# EAGLE design Draft1 (EAGLE 9.6.2)

## Sheet 1 of 7: Power
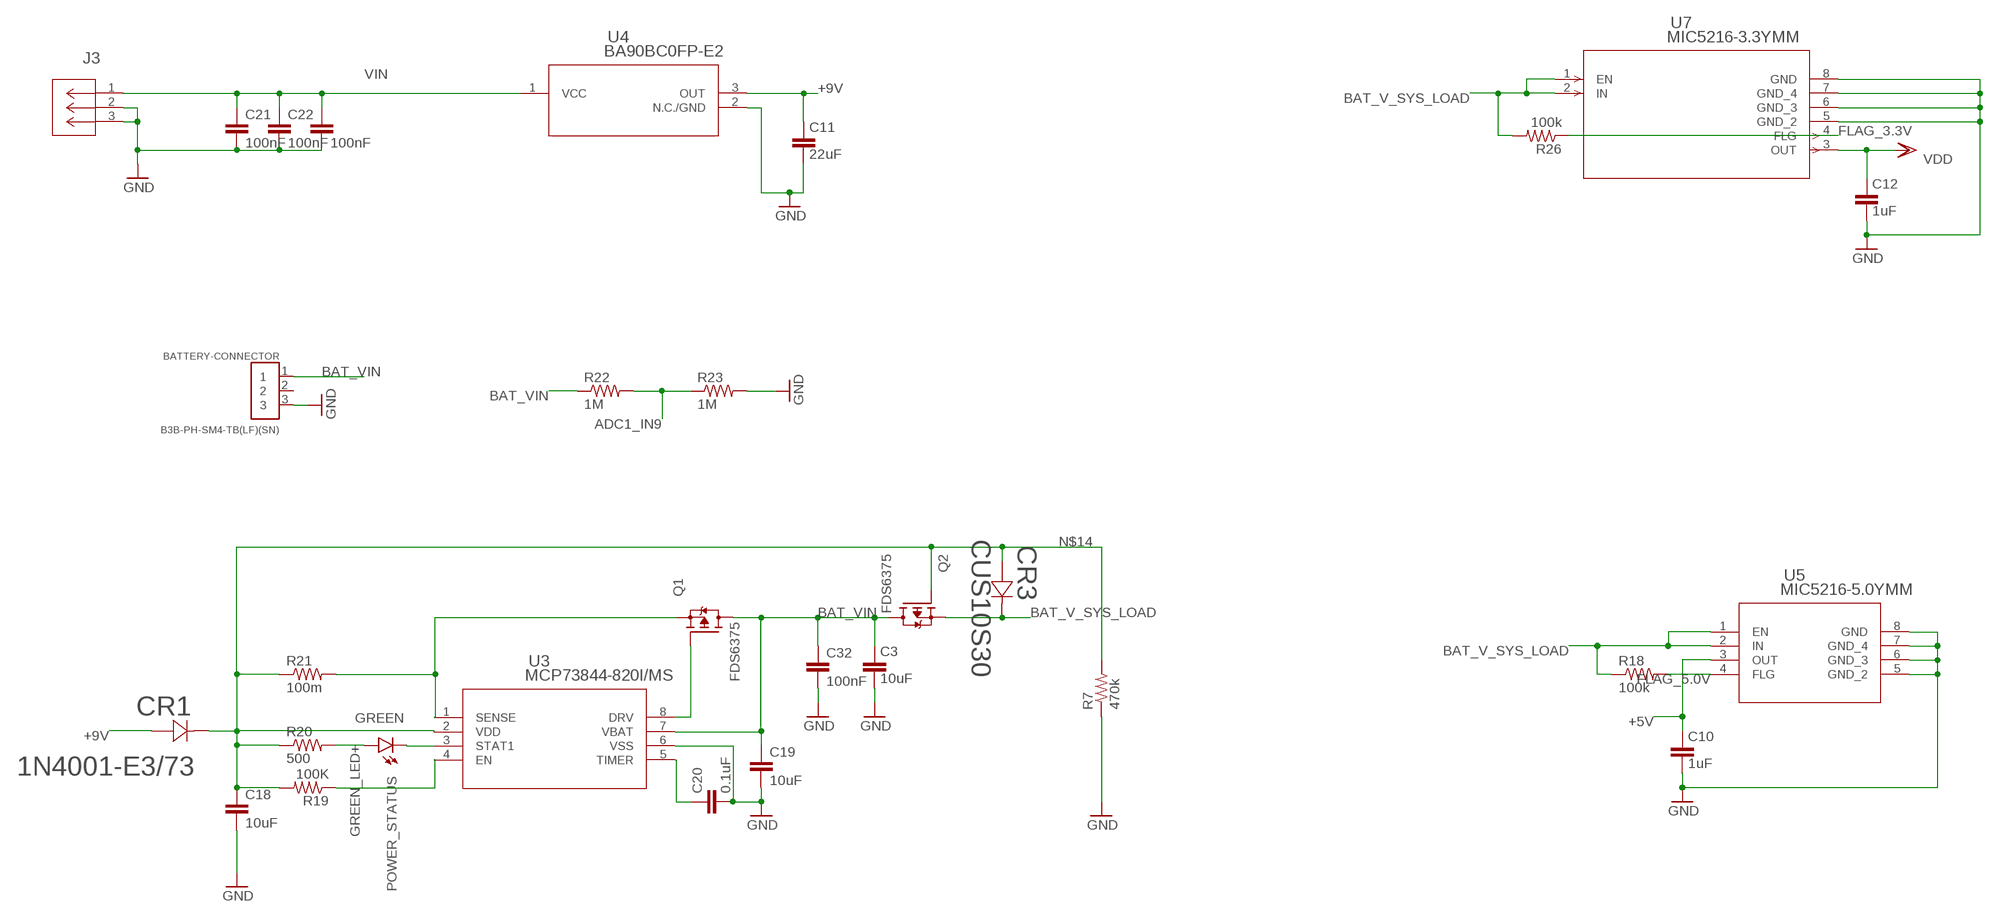
[diagram p0: schematic, sheet 1]

### Parts
BATTERY-CONNECTOR  B3B-PH-SM4-TB(LF)(SN)  [JST_B3B-PH-SM4-TB(LF)(SN)]
C3  10uF  C-EUC0603  [C0603]
C10  1uF  C-EUC0603  [C0603]
C11  22uF  C-EUC0603  [C0603]
C12  1uF  C-EUC0603  [C0603]
C18  10uF  C-EUC0603  [C0603]
C19  10uF  C-EUC0603  [C0603]
C20  0.1uF  C-EUC0603  [C0603]
C21  100nF  C-EUC0603  [C0603]
C22  100nF  C-EUC0603  [C0603]
C23  100nF  C-EUC0603  [C0603]
C32  100nF  C-EUC0603  [C0603]
CR1  1N4001-E3/73  [DO-204AL_VIS]
CR3  CUS10S30  [USC_TOS]
J3  EJ503B  [CONN_EJ503B_MPD]
POWER_STATUS  GREEN  LEDSMT1206  [1206]
Q1  FDS6375  [SOIC127P600X175-8N]
Q2  FDS6375  [SOIC127P600X175-8N]
R7  470k  R-US_R0603  [R0603]
R18  100k  R-US_R0603  [R0603]
R19  100K  R-US_R0603  [R0603]
R20  500  R-US_R0603  [R0603]
R21  100m  R-US_R0603  [R0603]
R22  1M  R-US_R0603  [R0603]
R23  1M  R-US_R0603  [R0603]
R26  100k  R-US_R0603  [R0603]
U3  MCP73844-820I/MS  [MSOP8_MC_MCH]
U4  BA90BC0FP-E2  [TO252-3_ROM]
U5  MIC5216-5.0YMM  [MSOP8_MM_MCH]
U7  MIC5216-3.3YMM  [MSOP-8_MM_MCL]

### Nets
+5V: C10.1 U5.3(OUT) ; also sheet 5,6
+9V: C11.1 CR1.2 U4.3(OUT)
ADC1_IN9: R22.2 R23.1 ; also sheet 2
BAT_V_SYS_LOAD: CR3.1(CATHODE) Q2.1(S) Q2.2(S) Q2.3(S) R18.1 R26.2 U5.1(EN) U5.2(IN) U7.1(EN) U7.2(IN)
BAT_VIN: BATTERY-CONNECTOR.1 C3.1 C19.1 C32.1 Q1.5(D) Q1.6(D) Q1.7(D) Q1.8(D) Q2.5(D) Q2.6(D) Q2.7(D) Q2.8(D) R22.1 U3.7(VBAT)
FLAG_3.3V: R26.1 U7.4(FLG)
FLAG_5.0V: R18.2 U5.4(FLG)
GND: BATTERY-CONNECTOR.3 C3.2 C10.2 C11.2 C12.2 C18.2 C19.2 C20.2 C21.2 C22.2 C23.2 C32.2 J3.2 J3.3 R7.1 R23.2 U3.6(VSS) U4.2(N.C./GND) U5.5(GND_2) U5.6(GND_3) U5.7(GND_4) U5.8(GND) U7.5(GND_2) U7.6(GND_3) U7.7(GND_4) U7.8(GND) ; also sheet 2,3,4,5,6,7
GREEN_LED+: POWER_STATUS.A R20.2
N$14: C18.1 CR1.1 CR3.2(ANODE) Q2.4(G) R7.2 R19.2 R20.1 R21.1 U3.2(VDD)
N$15: R19.1 U3.4(EN)
N$16: POWER_STATUS.C U3.3(STAT1)
N$18: Q1.4(G) U3.8(DRV)
N$19: Q1.1(S) Q1.2(S) Q1.3(S) R21.2 U3.1(SENSE)
N$20: C20.1 U3.5(TIMER)
VDD: C12.1 U7.3(OUT) ; also sheet 2,3,4,6,7
VIN: C21.1 C22.1 C23.1 J3.1 U4.1(VCC)
Unconnected: BATTERY-CONNECTOR.2

## Sheet 2 of 7: MCU
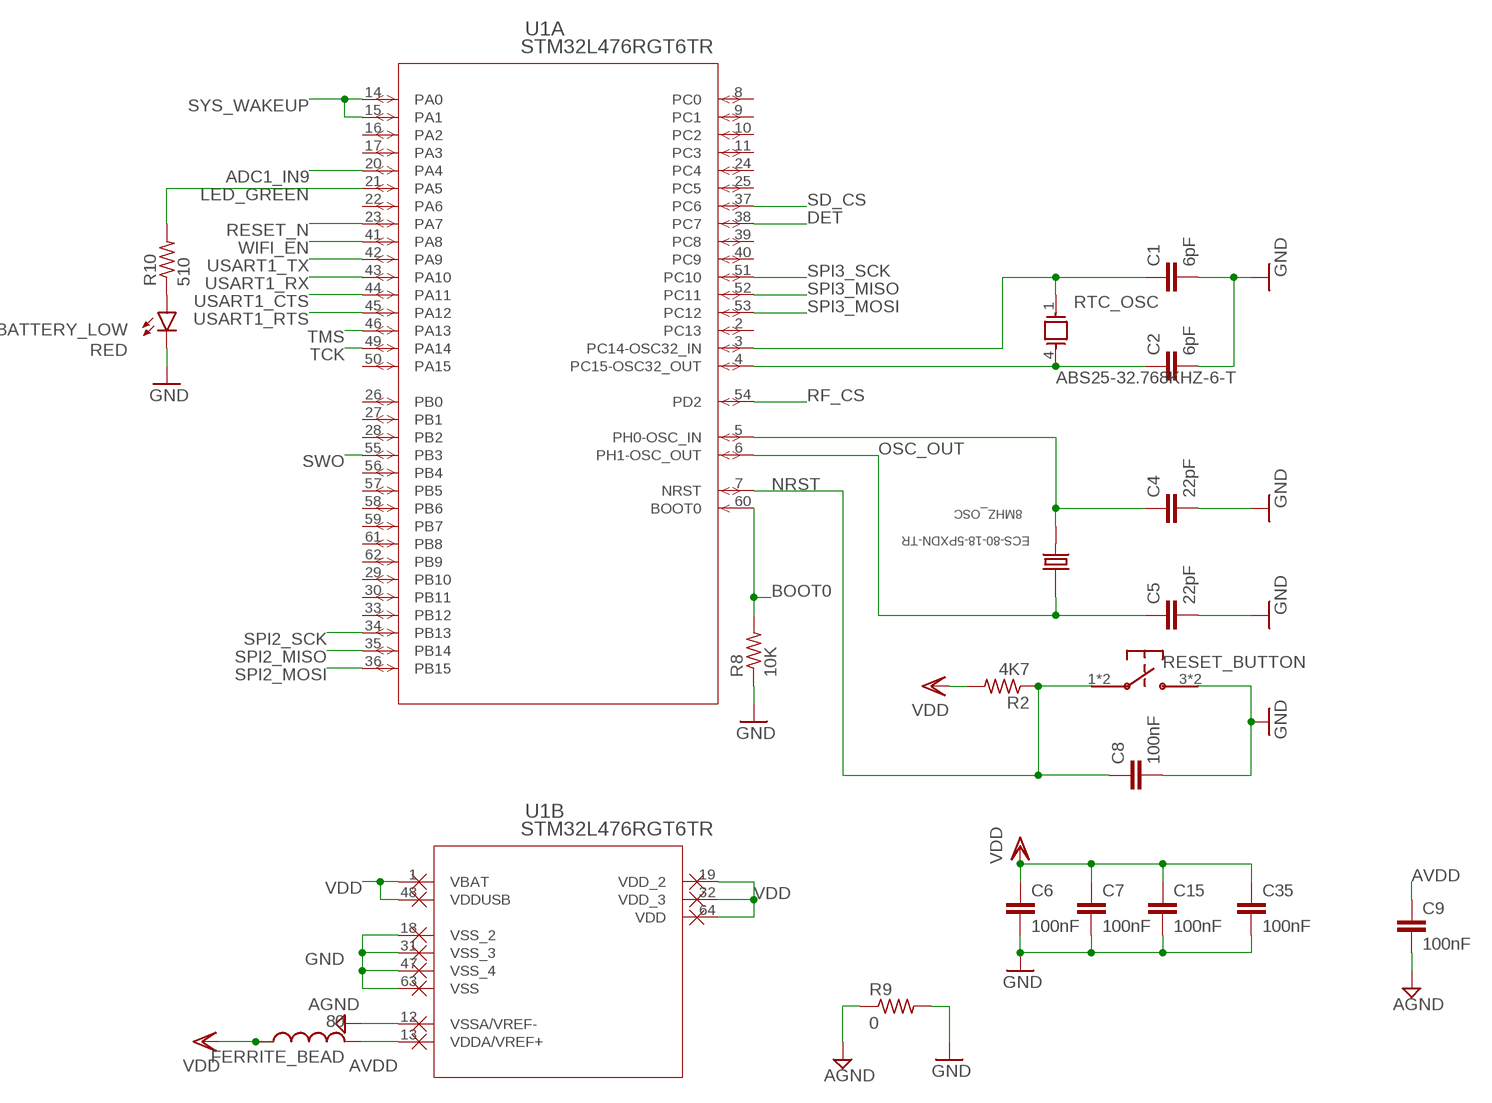
[diagram p1: schematic, sheet 2]

### Parts
8MHZ_OSC  ECS-80-18-5PXDN-TR  [XTAL_ECS-80-18-5PXDN-TR]
BATTERY_LOW  RED  LEDSMT1206  [1206]
C1  6pF  C-EUC0603  [C0603]
C2  6pF  C-EUC0603  [C0603]
C4  22pF  C-EUC0603  [C0603]
C5  22pF  C-EUC0603  [C0603]
C6  100nF  C-EUC0603  [C0603]
C7  100nF  C-EUC0603  [C0603]
C8  100nF  C-EUC0603  [C0603]
C9  100nF  C-EUC0603  [C0603]
C15  100nF  C-EUC0603  [C0603]
C35  100nF  C-EUC0603  [C0603]
FERRITE_BEAD  80  L-USL3216C  [L3216C]
R2  4K7  R-US_R0603  [R0603]
R8  10K  R-US_R0603  [R0603]
R9  0  R-US_R0603  [R0603]
R10  510  R-US_R0603  [R0603]
RESET_BUTTON  PTS645SM43SMTR  [PTS645SM43SMTR]
RTC_OSC  ABS25-32.768KHZ-6-T  [XTAL_ABS25-32.768KHZ-6-T]
U1  STM32L476RGT6TR  [LQFP64-10X10MM]

### Nets
ADC1_IN9: U1.20(A:PA4) ; also sheet 1
AGND: C9.2 R9.1 U1.12(B:VSSA/VREF-)
AVDD: C9.1 FERRITE_BEAD.2 U1.13(B:VDDA/VREF+)
BOOT0: R8.2 U1.60(A:BOOT0)
DET: U1.38(A:PC7) ; also sheet 4
GND: BATTERY_LOW.C C1.2 C2.2 C4.2 C5.2 C6.2 C7.2 C8.2 C15.2 C35.2 R8.1 R9.2 RESET_BUTTON.3 RESET_BUTTON.4 U1.18(B:VSS_2) U1.31(B:VSS_3) U1.47(B:VSS_4) U1.63(B:VSS) ; also sheet 1,3,4,5,6,7
LED_GREEN: R10.2 U1.21(A:PA5)
N$2: BATTERY_LOW.A R10.1
N$6: C1.1 RTC_OSC.1 U1.3(A:PC14-OSC32_IN)
N$8: C2.1 RTC_OSC.4 U1.4(A:PC15-OSC32_OUT)
NRST: C8.1 R2.1 RESET_BUTTON.1 RESET_BUTTON.2 U1.7(A:NRST) ; also sheet 3
OSC_IN: 8MHZ_OSC.2 C4.1 U1.5(A:PH0-OSC_IN)
OSC_OUT: 8MHZ_OSC.1 C5.1 U1.6(A:PH1-OSC_OUT) ; also sheet 6
RESET_N: U1.23(A:PA7) ; also sheet 7
RF_CS: U1.54(A:PD2) ; also sheet 6
SD_CS: U1.37(A:PC6) ; also sheet 4
SPI2_MISO: U1.35(A:PB14) ; also sheet 4
SPI2_MOSI: U1.36(A:PB15) ; also sheet 4
SPI2_SCK: U1.34(A:PB13) ; also sheet 4
SPI3_MISO: U1.52(A:PC11) ; also sheet 6
SPI3_MOSI: U1.53(A:PC12) ; also sheet 6
SPI3_SCK: U1.51(A:PC10) ; also sheet 6
SWO: U1.55(A:PB3) ; also sheet 3
SYS_WAKEUP: U1.14(A:PA0) U1.15(A:PA1) ; also sheet 5
TCK: U1.49(A:PA14) ; also sheet 3
TMS: U1.46(A:PA13) ; also sheet 3
USART1_CTS: U1.44(A:PA11) ; also sheet 7
USART1_RTS: U1.45(A:PA12) ; also sheet 7
USART1_RX: U1.43(A:PA10) ; also sheet 7
USART1_TX: U1.42(A:PA9) ; also sheet 7
VDD: C6.1 C7.1 C15.1 C35.1 FERRITE_BEAD.1 R2.2 U1.1(B:VBAT) U1.19(B:VDD_2) U1.32(B:VDD_3) U1.48(B:VDDUSB) U1.64(B:VDD) ; also sheet 1,3,4,6,7
WIFI_EN: U1.41(A:PA8) ; also sheet 7
Unconnected: U1.2(A:PC13) U1.8(A:PC0) U1.9(A:PC1) U1.10(A:PC2) U1.11(A:PC3) U1.16(A:PA2) U1.17(A:PA3) U1.22(A:PA6) U1.24(A:PC4) U1.25(A:PC5) U1.26(A:PB0) U1.27(A:PB1) U1.28(A:PB2) U1.29(A:PB10) U1.30(A:PB11) U1.33(A:PB12) U1.39(A:PC8) U1.40(A:PC9) U1.50(A:PA15) U1.56(A:PB4) U1.57(A:PB5) U1.58(A:PB6) U1.59(A:PB7) U1.61(A:PB8) U1.62(A:PB9)

## Sheet 3 of 7: STLINK
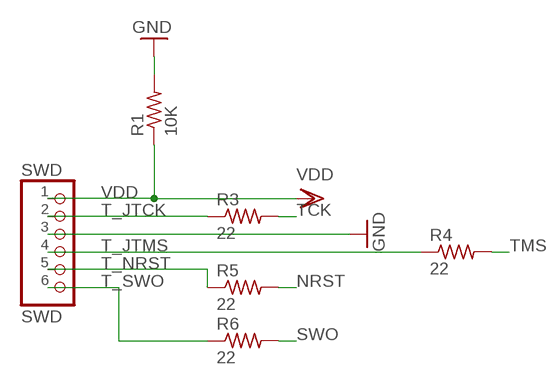
[diagram p2: schematic, sheet 3]

### Parts
R1  10K  R-US_R0603  [R0603]
R3  22  R-US_R0603  [R0603]
R4  22  R-US_R0603  [R0603]
R5  22  R-US_R0603  [R0603]
R6  22  R-US_R0603  [R0603]
SWD  SWD  PINHD-1X6  [1X06]

### Nets
GND: R1.2 SWD.3 ; also sheet 1,2,4,5,6,7
NRST: R5.2 ; also sheet 2
SWO: R6.2 ; also sheet 2
T_JTCK: R3.1 SWD.2
T_JTMS: R4.1 SWD.4
T_NRST: R5.1 SWD.5
T_SWO: R6.1 SWD.6
TCK: R3.2 ; also sheet 2
TMS: R4.2 ; also sheet 2
VDD: R1.1 SWD.1 ; also sheet 1,2,4,6,7

## Sheet 4 of 7: microSD
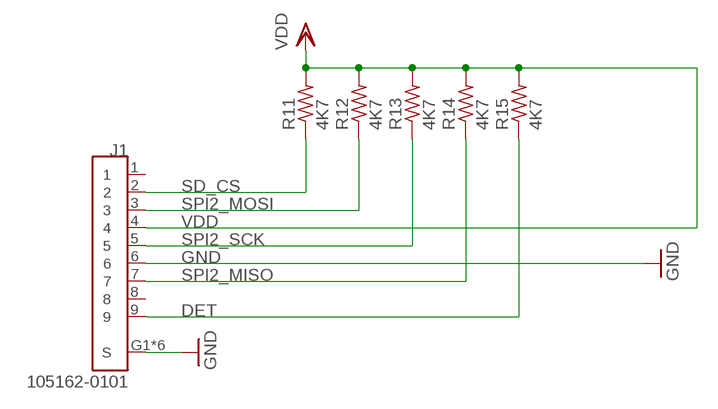
[diagram p3: schematic, sheet 4]

### Parts
J1  105162-0101  [MOLEX_105162-0101]
R11  4K7  R-US_R0603  [R0603]
R12  4K7  R-US_R0603  [R0603]
R13  4K7  R-US_R0603  [R0603]
R14  4K7  R-US_R0603  [R0603]
R15  4K7  R-US_R0603  [R0603]

### Nets
DET: J1.9 R15.1 ; also sheet 2
GND: J1.6 J1.G1(S) J1.G2(S) J1.G3(S) J1.G4(S) J1.SH1(S) J1.SH2(S) ; also sheet 1,2,3,5,6,7
SD_CS: J1.2 R11.1 ; also sheet 2
SPI2_MISO: J1.7 R14.1 ; also sheet 2
SPI2_MOSI: J1.3 R12.1 ; also sheet 2
SPI2_SCK: J1.5 R13.1 ; also sheet 2
VDD: J1.4 R11.2 R12.2 R13.2 R14.2 R15.2 ; also sheet 1,2,3,6,7
Unconnected: J1.1 J1.8

## Sheet 5 of 7: Infrared Motion Sensor Connectors
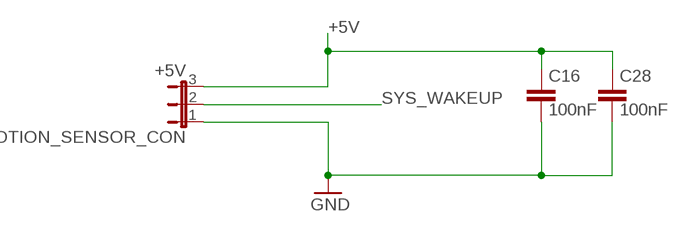
[diagram p4: schematic, sheet 5]

### Parts
C16  100nF  C-EUC0603  [C0603]
C28  100nF  C-EUC0603  [C0603]
MOTION_SENSOR_CON  +5V  JP2E  [JP2]

### Nets
+5V: C16.1 C28.1 MOTION_SENSOR_CON.3 ; also sheet 1,6
GND: C16.2 C28.2 MOTION_SENSOR_CON.1 ; also sheet 1,2,3,4,6,7
SYS_WAKEUP: MOTION_SENSOR_CON.2 ; also sheet 2

## Sheet 6 of 7: RFID Reader
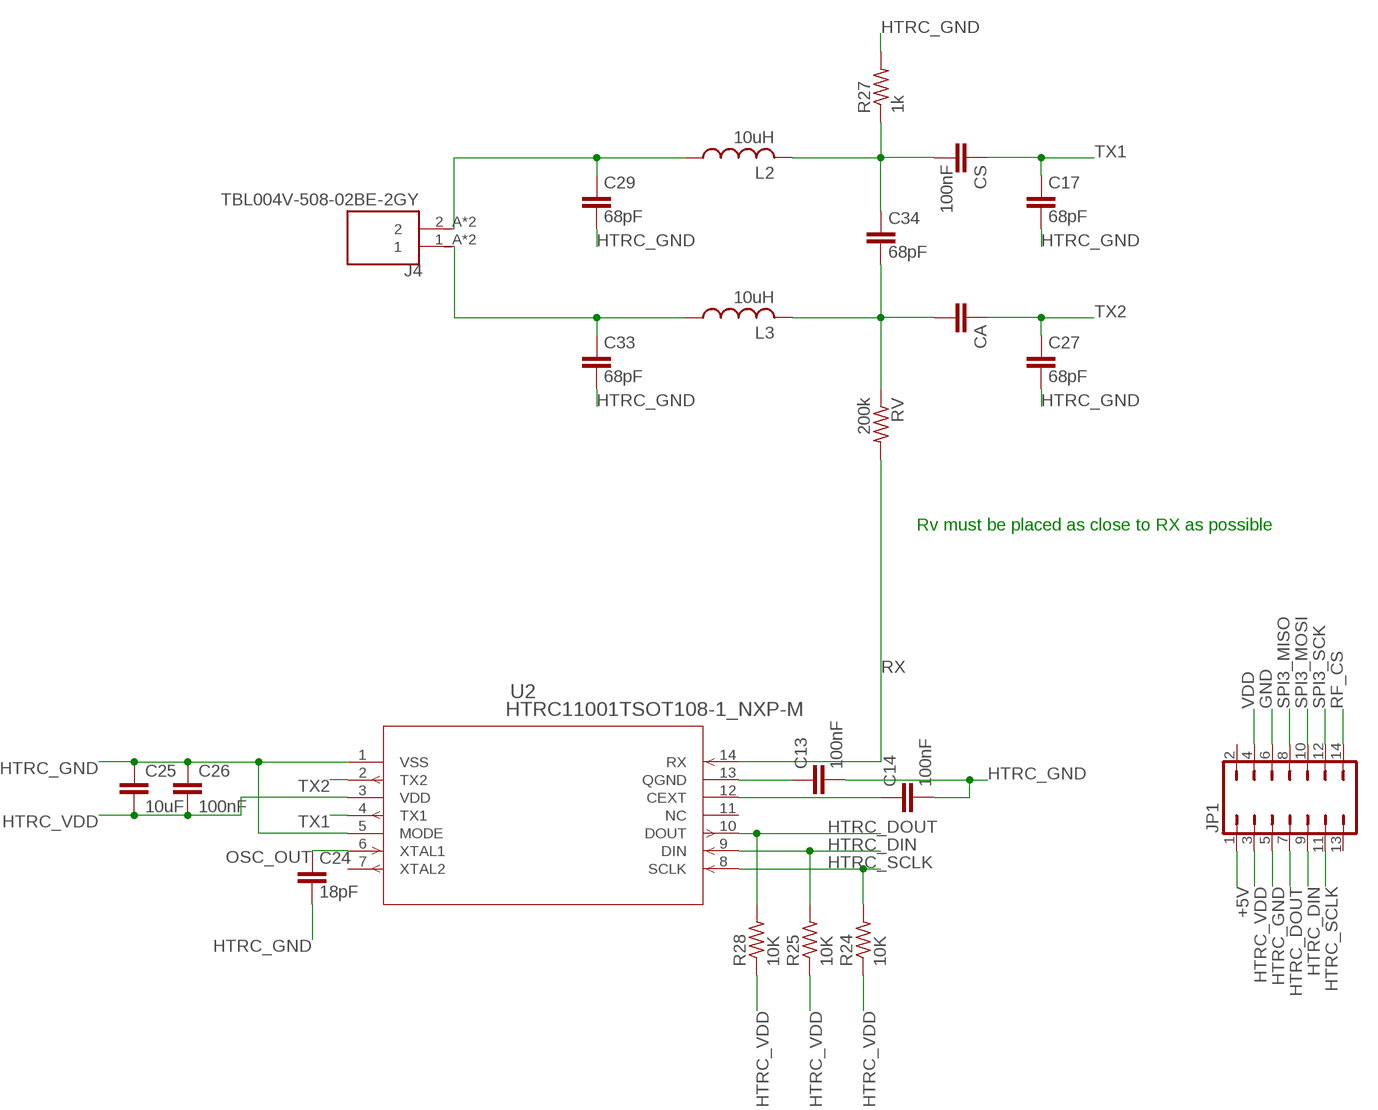
[diagram p5: schematic, sheet 6]

### Parts
C13  100nF  C-EUC0603  [C0603]
C14  100nF  C-EUC0603  [C0603]
C17  68pF  C-EUC0603  [C0603]
C24  18pF  C-EUC0603  [C0603]
C25  10uF  C-EUC0603  [C0603]
C26  100nF  C-EUC0603  [C0603]
C27  68pF  C-EUC0603  [C0603]
C29  68pF  C-EUC0603  [C0603]
C33  68pF  C-EUC0603  [C0603]
C34  68pF  C-EUC0603  [C0603]
CA  C-EUC0603  [C0603]
CS  100nF  C-EUC0603  [C0603]
J4  TBL004V-508-02BE-2GY  [CUI_TBL004V-508-02BE-2GY]
JP1  JP7Q  [JP7Q]
L2  10uH  L-USL3225M  [L3225M]
L3  10uH  L-USL3225M  [L3225M]
R24  10K  R-US_R0603  [R0603]
R25  10K  R-US_R0603  [R0603]
R27  1k  R-US_R0603  [R0603]
R28  10K  R-US_R0603  [R0603]
RV  200k  R-US_R0603  [R0603]
U2  HTRC11001TSOT108-1_NXP-M  [SOT108-1_NXP-M]

### Nets
+5V: JP1.1 ; also sheet 1,5
GND: JP1.6 ; also sheet 1,2,3,4,5,7
HTRC_DIN: JP1.9 R25.2 U2.9(DIN)
HTRC_DOUT: JP1.7 R28.2 U2.10(DOUT)
HTRC_GND: C13.2 C14.2 C17.2 C24.2 C25.1 C26.1 C27.2 C29.2 C33.2 JP1.5 R27.2 U2.1(VSS) U2.5(MODE)
HTRC_SCLK: JP1.11 R24.2 U2.8(SCLK)
HTRC_VDD: C25.2 C26.2 JP1.3 R24.1 R25.1 R28.1 U2.3(VDD)
N$1: C33.1 J4.1_A J4.1_B L3.1
N$7: C29.1 J4.2_A J4.2_B L2.1
N$10: C34.1 CS.2 L2.2 R27.1
N$11: C13.1 U2.13(QGND)
N$12: C34.2 CA.2 L3.2 RV.1
N$21: C14.1 U2.12(CEXT)
OSC_OUT: C24.1 U2.6(XTAL1) ; also sheet 2
RF_CS: JP1.14 ; also sheet 2
RX: RV.2 U2.14(RX)
SPI3_MISO: JP1.8 ; also sheet 2
SPI3_MOSI: JP1.10 ; also sheet 2
SPI3_SCK: JP1.12 ; also sheet 2
TX1: C17.1 CS.1 U2.4(TX1)
TX2: C27.1 CA.1 U2.2(TX2)
VDD: JP1.4 ; also sheet 1,2,3,4,7
Unconnected: JP1.2 JP1.13 U2.7(XTAL2) U2.11(NC)

### Notes on the sheet
- Rv must be placed as close to RX as possible

## Sheet 7 of 7: WIFI Module
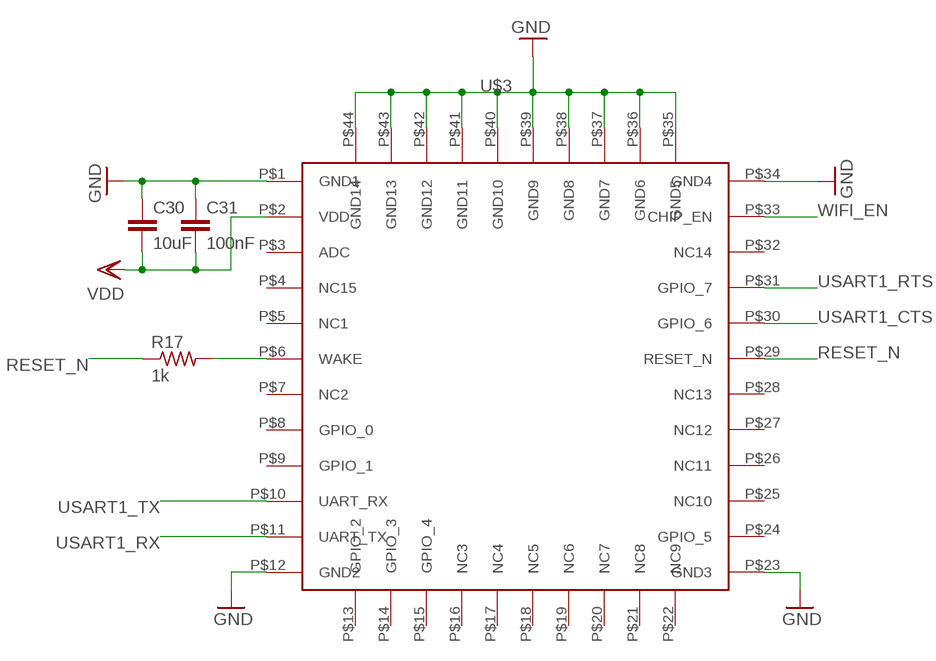
[diagram p6: schematic, sheet 7]

### Parts
C30  10uF  C-EUC0603  [C0603]
C31  100nF  C-EUC0603  [C0603]
R17  1k  R-US_R0603  [R0603]
U$3  AMW037-2.2.14R  [AMW037-2.2.14R]

### Nets
GND: C30.1 C31.1 U$3.P$1(GND1) U$3.P$12(GND2) U$3.P$23(GND3) U$3.P$34(GND4) U$3.P$35(GND5) U$3.P$36(GND6) U$3.P$37(GND7) U$3.P$38(GND8) U$3.P$39(GND9) U$3.P$40(GND10) U$3.P$41(GND11) U$3.P$42(GND12) U$3.P$43(GND13) U$3.P$44(GND14) ; also sheet 1,2,3,4,5,6
N$27: R17.2 U$3.P$6(WAKE)
RESET_N: R17.1 U$3.P$29(RESET_N) ; also sheet 2
USART1_CTS: U$3.P$30(GPIO_6) ; also sheet 2
USART1_RTS: U$3.P$31(GPIO_7) ; also sheet 2
USART1_RX: U$3.P$11(UART_TX) ; also sheet 2
USART1_TX: U$3.P$10(UART_RX) ; also sheet 2
VDD: C30.2 C31.2 U$3.P$2(VDD) ; also sheet 1,2,3,4,6
WIFI_EN: U$3.P$33(CHIP_EN) ; also sheet 2
Unconnected: U$3.P$3(ADC) U$3.P$4(NC15) U$3.P$5(NC1) U$3.P$7(NC2) U$3.P$8(GPIO_0) U$3.P$9(GPIO_1) U$3.P$13(GPIO_2) U$3.P$14(GPIO_3) U$3.P$15(GPIO_4) U$3.P$16(NC3) U$3.P$17(NC4) U$3.P$18(NC5) U$3.P$19(NC6) U$3.P$20(NC7) U$3.P$21(NC8) U$3.P$22(NC9) U$3.P$24(GPIO_5) U$3.P$25(NC10) U$3.P$26(NC11) U$3.P$27(NC12) U$3.P$28(NC13) U$3.P$32(NC14)

## Library data of the parts
8MHZ_OSC = ECS-80-18-5PXDN-TR:ECS-80-18-5PXDN-TR: CRYSTAL SMD; DESCRIPTION: 8 MHz ±30ppm Crystal 18pF 60 Ohms HC-49/US; DIGI-KEY_PART_NUMBER: XC1297CT-ND; MF: ECS Inc.; MP: ECS-80-18-5PXDN-TR; PACKAGE: HC49/US ECS International; PURCHASE-URL: https://pricing.snapeda.com/search/part/ECS-80-18-5PXDN-TR/?ref=eda
BATTERY-CONNECTOR = B3B-PH-SM4-TB_LF__SN_:B3B-PH-SM4-TB(LF)(SN): PH Series 3 Position 2 mm Pitch Crimp Surface Mount Top Entry Shrouded Header; DESCRIPTION: Connector Header Surface Mount 3 position 0.079 (2.00mm); DIGI-KEY_PART_NUMBER: 455-1735-1-ND; MF: JST Sales; MP: B3B-PH-SM4-TB(LF)(SN); PACKAGE: None; PURCHASE-URL: https://pricing.snapeda.com/search/part/B3B-PH-SM4-TB(LF)(SN)/?ref=eda
BATTERY_LOW = led:LED: LED OSRAM: - CHIPLED LG R971, LG N971, LY N971, LG Q971, LY Q971, LO R971, LY R971 LH N974, LH R974 LS Q976, LO Q976, LY Q976 LO Q996 - Hyper CHIPLED LW Q18S LB Q993, LB Q99A, LB R99A - SideLED LS A670, LO A670, LY A670, LG A670, LP A670 LB A673, LV A673, LT A673, LW A673 LH A674 LY A675 LS A676, LA A676, LO A676, LY A676, LW A676 LS A679, LY A679, LG A679 - Hyper Micro SIDELED® LS Y876, LA Y876, LO Y876, LY Y876 LT Y87S - SmartLED LW L88C, LW L88S LB L89C, LB L89S, LG L890 LS L89K, LO L89K, LY L89K LS L896, LA L896, LO L896, LY L896 - TOPLED LS T670, LO T670, LY T670, LG T670, LP T670 LSG T670, LSP T670, LSY T670, LOP T670, LYG T670 LG T671, LOG T671, LSG T671 LB T673, LV T673, LT T673, LW T673 LH T674 LS T676, LA T676, LO T676, LY T676, LB T676, LH T676, LSB T676, LW T676 LB T67C, LV T67C, LT T67C, LS T67K, LO T67K, LY T67K, LW E67C LS E67B, LA E67B, LO E67B, LY E67B, LB E67C, LV E67C, LT E67C LW T67C LS T679, LY T679, LG T679 LS T770, LO T770, LY T770, LG T770, LP T770 LB T773, LV T773, LT T773, LW T773 LH T774 LS E675, LA E675, LY E675, LS T675 LS T776, LA T776, LO T776, LY T776, LB T776 LHGB T686 LT T68C, LB T68C - Hyper Mini TOPLED® LB M676 - Mini TOPLED Santana® LG M470 LS M47K, LO M47K, LY M47K Source: http://www.osram.convergy.de LUXEON: - LUMILED® LXK2-PW12-R00, LXK2-PW12-S00, LXK2-PW14-U00, LXK2-PW14-V00 LXK2-PM12-R00, LXK2-PM12-S00, LXK2-PM14-U00 LXK2-PE12-Q00, LXK2-PE12-R00, LXK2-PE12-S00, LXK2-PE14-T00, LXK2-PE14-U00 LXK2-PB12-K00, LXK2-PB12-L00, LXK2-PB12-M00, LXK2-PB14-N00, LXK2-PB14-P00, LXK2-PB14-Q00 LXK2-PR12-L00, LXK2-PR12-M00, LXK2-PR14-Q00, LXK2-PR14-R00 LXK2-PD12-Q00, LXK2-PD12-R00, LXK2-PD12-S00 LXK2-PH12-R00, LXK2-PH12-S00 LXK2-PL12-P00, LXK2-PL12-Q00, LXK2-PL12-R00 Source: www.luxeon.com KINGBRIGHT: KA-3528ASYC Source: www.kingbright.com
C1-C35 CA CS = rcl:C-EU: CAPACITOR, European symbol; SPICEPREFIX: C
CR1 = 1N4001:1N4001-E3/73; COPYRIGHT: Copyright (C) 2021 Ultra Librarian. All rights reserved.; DIGI-KEY_PART_NUMBER_1: 1N4001-E3/73GICT-ND; DIGI-KEY_PART_NUMBER_2: 1N4001-E3/73GITB-ND; MANUFACTURER_PART_NUMBER: 1N4001-E3/73; MFR_NAME: Vishay; SPICEPREFIX: C
CR3 = CUS10S30:CUS10S30; COPYRIGHT: Copyright (C) 2021 Ultra Librarian. All rights reserved.; DIGI-KEY_PART_NUMBER_1: CUS10S30H3FCT-ND; DIGI-KEY_PART_NUMBER_2: CUS10S30H3FDKR-ND; DIGI-KEY_PART_NUMBER_3: CUS10S30H3FTR-ND; MANUFACTURER_PART_NUMBER: CUS10S30; MFR_NAME: Toshiba Electronic Devices & Storage Co.
FERRITE_BEAD L2 L3 = rcl:L-US: INDUCTOR, American symbol; SPICEPREFIX: L
J1 = microSD header:105162-0101: 1.10mm Pitch microSD Card Header with Detect Pin, Height 1.45mm, Lead-Free, Gold (Au) Plated 0.762µm; DESCRIPTION: 9 (8 + 1) Position Card Connector Secure Digital - microSD™ Surface Mount, Right Angle Gold; DIGI-KEY_PART_NUMBER: WM12823CT-ND; MF: Molex; MP: 1051620101; PACKAGE: None; PURCHASE-URL: https://pricing.snapeda.com/search/part/1051620101/?ref=eda
J3 = DC jack connector:EJ503B; COPYRIGHT: Copyright (C) 2021 Ultra Librarian. All rights reserved.; DIGI-KEY_PART_NUMBER_1: EJ503B-ND; MANUFACTURER_PART_NUMBER: EJ503B; MFR_NAME: Memory Protection Devices
J4 = TBL004V-508-02BE-2GY:TBL004V-508-02BE-2GY: Check prices <https://pricing.snapeda.com/parts/TBL004V-508-02BE-2GY/CUI%20Devices/view-part?ref=eda>; AVAILABILITY: In Stock; CUI_PURCHASE_URL: https://www.cuidevices.com/product/interconnect/connectors/terminal-blocks/tbl004v-508-series?utm_source=snapeda.com&utm_medium=referral&utm_campaign=snapedaBOM; DESCRIPTION: 2~24 Poles, Screwless, Vertical, 5.08 Pitch, 24~14 (AWG), Terminal Block Connector; MF: CUI Devices; MP: TBL004V-508-02BE-2GY; PACKAGE: None; PRICE: None; PURCHASE-URL: https://pricing.snapeda.com/search/part/TBL004V-508-02BE-2GY/?ref=eda
JP1 = jumper:JP7Q: JUMPER
MOTION_SENSOR_CON = jumper:JP2E: JUMPER
POWER_STATUS = led:LED: LED OSRAM: - CHIPLED LG R971, LG N971, LY N971, LG Q971, LY Q971, LO R971, LY R971 LH N974, LH R974 LS Q976, LO Q976, LY Q976 LO Q996 - Hyper CHIPLED LW Q18S LB Q993, LB Q99A, LB R99A - SideLED LS A670, LO A670, LY A670, LG A670, LP A670 LB A673, LV A673, LT A673, LW A673 LH A674 LY A675 LS A676, LA A676, LO A676, LY A676, LW A676 LS A679, LY A679, LG A679 - Hyper Micro SIDELED® LS Y876, LA Y876, LO Y876, LY Y876 LT Y87S - SmartLED LW L88C, LW L88S LB L89C, LB L89S, LG L890 LS L89K, LO L89K, LY L89K LS L896, LA L896, LO L896, LY L896 - TOPLED LS T670, LO T670, LY T670, LG T670, LP T670 LSG T670, LSP T670, LSY T670, LOP T670, LYG T670 LG T671, LOG T671, LSG T671 LB T673, LV T673, LT T673, LW T673 LH T674 LS T676, LA T676, LO T676, LY T676, LB T676, LH T676, LSB T676, LW T676 LB T67C, LV T67C, LT T67C, LS T67K, LO T67K, LY T67K, LW E67C LS E67B, LA E67B, LO E67B, LY E67B, LB E67C, LV E67C, LT E67C LW T67C LS T679, LY T679, LG T679 LS T770, LO T770, LY T770, LG T770, LP T770 LB T773, LV T773, LT T773, LW T773 LH T774 LS E675, LA E675, LY E675, LS T675 LS T776, LA T776, LO T776, LY T776, LB T776 LHGB T686 LT T68C, LB T68C - Hyper Mini TOPLED® LB M676 - Mini TOPLED Santana® LG M470 LS M47K, LO M47K, LY M47K Source: http://www.osram.convergy.de LUXEON: - LUMILED® LXK2-PW12-R00, LXK2-PW12-S00, LXK2-PW14-U00, LXK2-PW14-V00 LXK2-PM12-R00, LXK2-PM12-S00, LXK2-PM14-U00 LXK2-PE12-Q00, LXK2-PE12-R00, LXK2-PE12-S00, LXK2-PE14-T00, LXK2-PE14-U00 LXK2-PB12-K00, LXK2-PB12-L00, LXK2-PB12-M00, LXK2-PB14-N00, LXK2-PB14-P00, LXK2-PB14-Q00 LXK2-PR12-L00, LXK2-PR12-M00, LXK2-PR14-Q00, LXK2-PR14-R00 LXK2-PD12-Q00, LXK2-PD12-R00, LXK2-PD12-S00 LXK2-PH12-R00, LXK2-PH12-S00 LXK2-PL12-P00, LXK2-PL12-Q00, LXK2-PL12-R00 Source: www.luxeon.com KINGBRIGHT: KA-3528ASYC Source: www.kingbright.com; SPICEPREFIX: B
Q1 = FDS6375:FDS6375; DESCRIPTION: This P-Channel 2.5V specified MOSFET is a rugged gate version of Fairchild Semiconductor's advanced PowerTrench process. It has been optimized for power management applications with a wide range of gate drive voltage (2.5V – 8V); DIGI-KEY_PART_NUMBER: FDS6375CT-ND; MF: ON Semiconductor; MP: FDS6375; PACKAGE: SO-8 ON Semiconductor; PURCHASE-URL: https://pricing.snapeda.com/search/part/FDS6375/?ref=eda; SPICEPREFIX: Q
Q2 = FDS6375:FDS6375; DESCRIPTION: This P-Channel 2.5V specified MOSFET is a rugged gate version of Fairchild Semiconductor's advanced PowerTrench process. It has been optimized for power management applications with a wide range of gate drive voltage (2.5V – 8V); DIGI-KEY_PART_NUMBER: FDS6375CT-ND; MF: ON Semiconductor; MP: FDS6375; PACKAGE: SO-8 ON Semiconductor; PURCHASE-URL: https://pricing.snapeda.com/search/part/FDS6375/?ref=eda
R1-R15 R17-R28 RV = rcl:R-US_: RESISTOR, American symbol; SPICEPREFIX: R
RESET_BUTTON = Tactile Switch Blue:PTS645SM43SMTR: SWITCH TACTILE SPST-NO 0.05A 12V Check prices <https://pricing.snapeda.com/parts/PTS645SM43SMTR/C%26K/view-part?ref=eda>; AVAILABILITY: In Stock; DESCRIPTION: Tactile Switch SPST-NO Top Actuated Surface Mount; MF: C&K; MP: PTS645SM43SMTR; PACKAGE: None; PRICE: None; PURCHASE-URL: https://pricing.snapeda.com/search/part/PTS645SM43SMTR/?ref=eda
RTC_OSC = ABS25-32.768KHZ-6-T:ABS25-32.768KHZ-6-T: ABS25 Series 32.768 kHz ±20 ppm 6 pF -40 to +85 °C SMT Low Frequency Crystal; DESCRIPTION: 32.768kHz ±20ppm Crystal 6pF 50 kOhms 4-SOJ, 5.50mm pitch; DIGI-KEY_PART_NUMBER: 535-10240-1-ND; MF: Abracon; MP: ABS25-32.768KHZ-6-T; PACKAGE: 4-4 Abracon; PURCHASE-URL: https://pricing.snapeda.com/search/part/ABS25-32.768KHZ-6-T/?ref=eda
SWD = pinhead:PINHD-1X6: PIN HEADER
U1 = STM32L4:STM32L476RGT6TR; COPYRIGHT: Copyright (C) 2021 Ultra Librarian. All rights reserved.; DIGI-KEY_PART_NUMBER_1: STM32L476RGT6TR-ND; DIGI-KEY_PART_NUMBER_2: 497-19382-1-ND; DIGI-KEY_PART_NUMBER_3: 497-19382-2-ND; DIGI-KEY_PART_NUMBER_4: 497-19382-6-ND; MANUFACTURER_PART_NUMBER: STM32L476RGT6TR; MFR_NAME: STMicroelectronics
U2 = HTRC11001T:HTRC11001T; COPYRIGHT: Copyright (C) 2021 Ultra Librarian. All rights reserved.; MANUFACTURER_PART_NUMBER: HTRC11001T; MFR_NAME: NXP
U3 = MCP73844-820I-MS:MCP73844-820I/MS; COPYRIGHT: Copyright (C) 2021 Ultra Librarian. All rights reserved.; DIGI-KEY_PART_NUMBER_1: MCP73844-820I/MS-ND; MANUFACTURER_PART_NUMBER: MCP73844-820I/MS; MFR_NAME: Microchip; SPICEPREFIX: X
U4 = BA90BC0FP-E2CT-ND:BA90BC0FP-E2; COPYRIGHT: Copyright (C) 2021 Ultra Librarian. All rights reserved.; DIGI-KEY_PART_NUMBER_1: BA90BC0FP-E2TR-ND; DIGI-KEY_PART_NUMBER_2: BA90BC0FP-E2CT-ND; DIGI-KEY_PART_NUMBER_3: BA90BC0FP-E2DKR-ND; MANUFACTURER_PART_NUMBER: BA90BC0FP-E2; MFR_NAME: ROHM Semiconductor
U5 = MIC5216-5.0YMM:MIC5216-5.0YMM; COPYRIGHT: Copyright (C) 2021 Ultra Librarian. All rights reserved.; DIGI-KEY_PART_NUMBER_1: 576-2990-ND; MANUFACTURER_PART_NUMBER: MIC5216-5.0YMM; MFR_NAME: Microchip
U7 = MIC5216-5.0YMM:MIC5216-3.3YMM; COPYRIGHT: Copyright (C) 2021 Ultra Librarian. All rights reserved.; DIGI-KEY_PART_NUMBER_1: 2156-MIC5216-3.3YMM-ND; DIGI-KEY_PART_NUMBER_2: 576-2375-ND; MANUFACTURER_PART_NUMBER: MIC5216-3.3YMM; MFR_NAME: Micrel
U$3 = AMW037:AMW037-2.2.14R

## Board
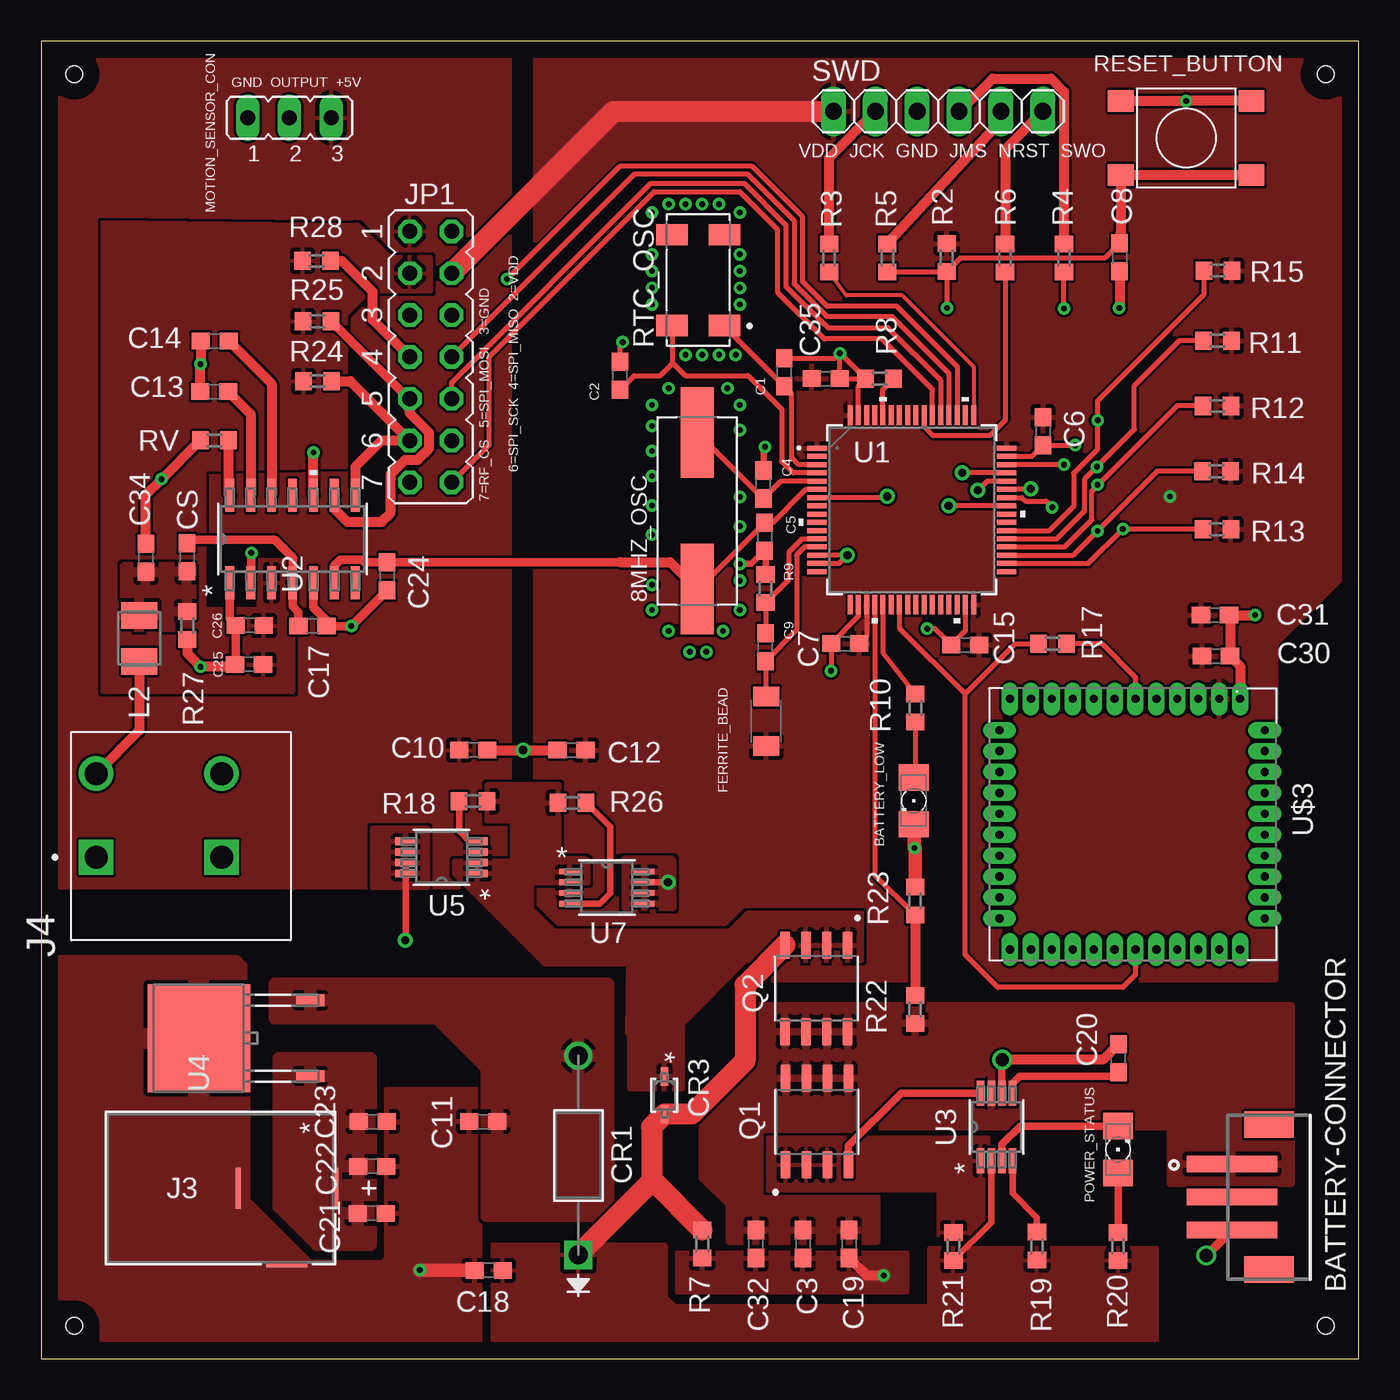
[diagram p7: board, top side]
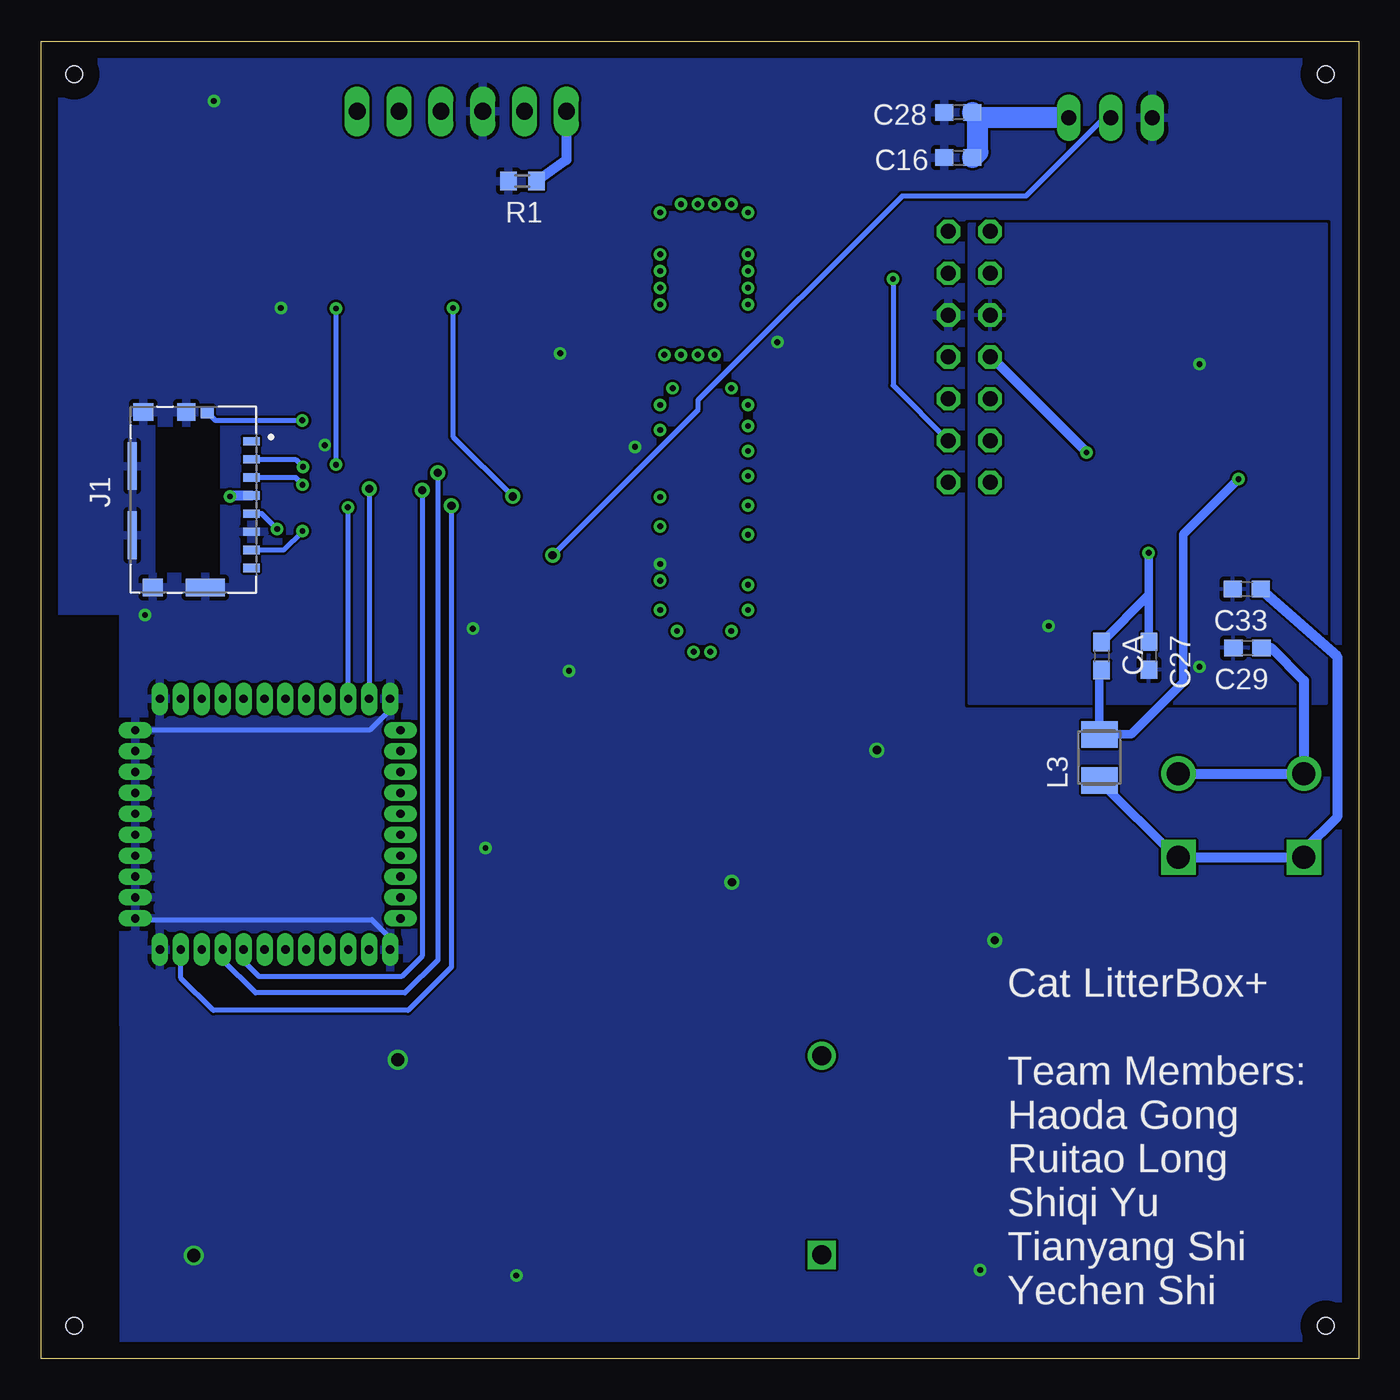
[diagram p8: board, bottom side, seen from below]

Size 80 x 80 mm. Coordinates in mm from the lower left corner, seen from the top.
Outline: 0,0 80,0 80,80 0,80 0,0
Copper layers (1*16): Top 0.035mm / dielectric 1.5mm / Bottom 0.035mm
Design rules "default": minimum track width 6mil, minimum drill 0.35mm, track to track 6mil, track to pad 6mil, pad to pad 6mil, via to via 6mil, smd to smd 6mil, copper to edge 40mil, drill to drill 6mil, minimum pad ring 10mil, minimum via ring 8mil, stop-mask expansion 4mil, vias tented up to drill 0mil, thermal gap 10mil
Holes 1 mm at 78,2 2,2.01 2.01,78 78,78

### Footprints (pad centres in the part's own frame; a part is rotated, then mirrored left to right if it is on the bottom)
XTAL_ECS-80-18-5PXDN-TR = smd 5.5 x 2: 1 -4.75,0; 2 4.75,0
JST_B3B-PH-SM4-TB(LF)(SN) = smd 1 x 5.5: 1 -2,-2.25; 2 0,-2.25; 3 2,-2.25 | smd 1.6 x 3: 4 4.4,0; 5 -4.4,0
1206 = smd 1.6 x 1.803: A -1.422,0; C 1.422,0
C0603 = smd 1.1 x 1: 1 -0.85,0; 2 0.85,0
DO-204AL_VIS = drill 1.143 pad 1.651 square: 1 0,0 | drill 1.143 pad 1.651: 2 12.09,0
USC_TOS = smd 1.111 x 0.451: 1 -1.15,0; 2 1.15,0
L3216C = smd 1.2 x 1.6: 1 -1.5,0; 2 1.5,0
MOLEX_105162-0101 = smd 0.5 x 1: 1 3.55,-3.515; 2 2.45,-3.515; 3 1.35,-3.515; 4 0.25,-3.515; 5 -0.85,-3.515; 6 -1.95,-3.515; 7 -3.05,-3.515; 8 -4.15,-3.515 | smd 0.72 x 0.78: 9 5.31,-0.835 | smd 1.05 x 1.08: G1 5.325,0.435 | smd 1.05 x 1.2: G2 5.325,3.045; G3 -5.325,2.475 | smd 1.05 x 2.39: G4 -5.325,-0.71 | smd 2.91 x 0.55: SH1 -2.145,3.72; SH2 2.045,3.72
CONN_EJ503B_MPD = smd 0.305 x 2.489: 1 0,0; 2 -5.93,0 | smd 2.489 x 0.305: 3 -2.965,-4.65
CUI_TBL004V-508-02BE-2GY = drill 1.4 square: 1_A 0,0; 1_B 0,-7.62 | drill 1.4: 2_A 5.08,0; 2_B 5.08,-7.62
JP7Q = drill 0.914 octagon: 1 -7.62,-1.27; 2 -7.62,1.27; 3 -5.08,-1.27; 4 -5.08,1.27; 5 -2.54,-1.27; 6 -2.54,1.27; 7 0,-1.27; 8 0,1.27; 9 2.54,-1.27; 10 2.54,1.27; 11 5.08,-1.27; 12 5.08,1.27; 13 7.62,-1.27; 14 7.62,1.27
L3225M = smd 1.6 x 2.2: 1 -1.4,0; 2 1.4,0
JP2 = drill 0.914 long: 1 -2.54,0; 2 0,0; 3 2.54,0
SOIC127P600X175-8N = smd 1.66 x 0.6: 1 -2.625,1.905; 2 -2.625,0.635; 3 -2.625,-0.635; 4 -2.625,-1.905; 5 2.625,-1.905; 6 2.625,-0.635; 7 2.625,0.635; 8 2.625,1.905
R0603 = smd 1 x 1.1: 1 -0.85,0; 2 0.85,0
PTS645SM43SMTR = smd 1.55 x 1.3: 1 -3.975,2.25; 2 3.975,2.25; 3 -3.975,-2.25; 4 3.975,-2.25
XTAL_ABS25-32.768KHZ-6-T = smd 1.9 x 1.3: 1 -1.6,2.75; 2 -1.6,-2.75; 3 1.6,-2.75; 4 1.6,2.75
1X06 = drill 1.016 long: 1 -6.35,0; 2 -3.81,0; 3 -1.27,0; 4 1.27,0; 5 3.81,0; 6 6.35,0
LQFP64-10X10MM = smd 1.194 x 0.305: 1 -5.75,3.75; 2 -5.75,3.25; 3 -5.75,2.75; 4 -5.75,2.25; 5 -5.75,1.75; 6 -5.75,1.25; 7 -5.75,0.75; 8 -5.75,0.25; 9 -5.75,-0.25; 10 -5.75,-0.75; 11 -5.75,-1.25; 12 -5.75,-1.75; 13 -5.75,-2.25; 14 -5.75,-2.75; 15 -5.75,-3.25; 16 -5.75,-3.75; 33 5.75,-3.75; 34 5.75,-3.25; 35 5.75,-2.75; 36 5.75,-2.25; 37 5.75,-1.75; 38 5.75,-1.25; 39 5.75,-0.75; 40 5.75,-0.25; 41 5.75,0.25; 42 5.75,0.75; 43 5.75,1.25; 44 5.75,1.75; 45 5.75,2.25; 46 5.75,2.75; 47 5.75,3.25; 48 5.75,3.75 | smd 0.305 x 1.194: 17 -3.75,-5.75; 18 -3.25,-5.75; 19 -2.75,-5.75; 20 -2.25,-5.75; 21 -1.75,-5.75; 22 -1.25,-5.75; 23 -0.75,-5.75; 24 -0.25,-5.75; 25 0.25,-5.75; 26 0.75,-5.75; 27 1.25,-5.75; 28 1.75,-5.75; 29 2.25,-5.75; 30 2.75,-5.75; 31 3.25,-5.75; 32 3.75,-5.75; 49 3.75,5.75; 50 3.25,5.75; 51 2.75,5.75; 52 2.25,5.75; 53 1.75,5.75; 54 1.25,5.75; 55 0.75,5.75; 56 0.25,5.75; 57 -0.25,5.75; 58 -0.75,5.75; 59 -1.25,5.75; 60 -1.75,5.75; 61 -2.25,5.75; 62 -2.75,5.75; 63 -3.25,5.75; 64 -3.75,5.75
SOT108-1_NXP-M = smd 2.007 x 0.533: 1 -2.654,3.81; 2 -2.654,2.54; 3 -2.654,1.27; 4 -2.654,0; 5 -2.654,-1.27; 6 -2.654,-2.54; 7 -2.654,-3.81; 8 2.654,-3.81; 9 2.654,-2.54; 10 2.654,-1.27; 11 2.654,0; 12 2.654,1.27; 13 2.654,2.54; 14 2.654,3.81
MSOP8_MC_MCH = smd 1.524 x 0.457: 1 -2.045,0.975; 2 -2.045,0.325; 3 -2.045,-0.325; 4 -2.045,-0.975; 5 2.045,-0.975; 6 2.045,-0.325; 7 2.045,0.325; 8 2.045,0.975
TO252-3_ROM = smd 0.711 x 1.702: 1 -2.3,-6.756; 3 2.3,-6.756 | smd 6.553 x 6.223: 2 0,0
MSOP8_MM_MCH = smd 1.257 x 0.457: 1 -2.178,0.975; 2 -2.178,0.325; 3 -2.178,-0.325; 4 -2.178,-0.975; 5 2.178,-0.975; 6 2.178,-0.325; 7 2.178,0.325; 8 2.178,0.975
MSOP-8_MM_MCL = smd 1.245 x 0.356: 1 -2.261,0.975; 2 -2.261,0.325; 3 -2.261,-0.325; 4 -2.261,-0.975; 5 2.261,-0.975; 6 2.261,-0.325; 7 2.261,0.325; 8 2.261,0.975
AMW037-2.2.14R = drill 0.5 pad 0.76 long: P$1 -7.61,6.52; P$2 -7.61,5.25; P$3 -7.61,3.98; P$4 -7.61,2.71; P$5 -7.61,1.44; P$6 -7.61,0.17; P$7 -7.61,-1.1; P$8 -7.61,-2.37; P$9 -7.61,-3.64; P$10 -7.61,-4.91; P$11 -7.61,-6.18; P$12 -7.61,-7.45; P$13 -5.71,-8.08; P$14 -4.44,-8.08; P$15 -3.17,-8.08; P$16 -1.9,-8.08; P$17 -0.63,-8.08; P$18 0.64,-8.08; P$19 1.91,-8.08; P$20 3.18,-8.08; P$21 4.45,-8.08; P$22 5.72,-8.08; P$23 7.61,-7.45; P$24 7.61,-6.18; P$25 7.61,-4.91; P$26 7.61,-3.64; P$28 7.61,-1.1; P$29 7.61,0.17; P$30 7.61,1.44; P$31 7.61,2.71; P$32 7.61,3.98; P$33 7.61,5.25; P$34 7.61,6.52; P$35 5.72,8.02; P$36 4.45,8.02; P$37 3.18,8.02; P$38 1.91,8.02; P$39 0.64,8.02; P$40 -0.63,8.02; P$41 -1.9,8.02; P$42 -3.17,8.02; P$43 -4.44,8.02; P$44 -5.71,8.02 | drill 0.5 pad 0.813 long: P$27 7.61,-2.37

### Placement (x,y rotation side)
8MHZ_OSC  39.83,51.48 90 top
BATTERY-CONNECTOR  74.55,9.82 270 top
BATTERY_LOW  52.98,33.88 270 top
C1  45.12,59.9 90 top
C2  35.14,59.68 90 top
C3  46.25,6.97 270 top
C4  43.86,53.09 90 top
C5  43.93,49.92 270 top
C6  60.83,56.32 270 top
C7  48.81,43.43 180 top
C8  65.47,66.88 270 top
C9  43.98,43.21 90 top
C10  26.23,36.96 0 top
C11  26.84,14.41 180 top
C12  32.2,36.96 180 top
C13  10.51,58.72 180 top
C14  10.54,61.8 180 top
C15  56.1,43.34 180 top
C16  24.31,72.93 180 bottom
C17  16.47,44.49 0 top
C18  27.18,5.37 180 top
C19  49.06,6.97 270 top
C20  65.4,18.24 90 top
C21  20.08,8.83 0 top
C22  20.09,11.68 0 top
C23  20.12,14.4 0 top
C24  21.01,47.52 270 top
C25  12.62,42.15 0 top
C26  12.67,44.52 0 top
C27  12.74,42.68 270 bottom
C28  24.31,75.68 180 bottom
C29  6.76,43.17 180 bottom
C30  71.33,42.66 180 top
C31  71.27,45.16 180 top
C32  43.39,6.97 270 top
C33  6.8,46.73 180 bottom
C34  6.36,48.63 90 top
C35  47.63,59.51 0 top
CA  15.62,42.67 270 bottom
CR1  32.61,6.31 90 top
CR3  37.84,16 270 top
CS  8.85,48.67 270 top
FERRITE_BEAD  44.02,38.71 90 top
J1  70.75,52.16 90 bottom
J3  17.89,10.36 0 top
J4  3.34,30.45 90 top
JP1  23.65,60.83 270 top
L2  5.96,43.74 90 top
L3  15.75,36.51 90 bottom
MOTION_SENSOR_CON  15.07,75.35 0 top
POWER_STATUS  65.38,12.71 90 top
Q1  47.1,14.4 90 top
Q2  47.06,22.49 270 top
R1  50.79,71.51 180 bottom
R2  54.98,66.86 90 top
R3  47.84,66.84 270 top
R4  62.1,66.83 270 top
R5  51.38,66.84 270 top
R6  58.52,66.84 270 top
R7  40.13,6.97 90 top
R8  50.91,59.5 0 top
R9  43.98,46.76 90 top
R10  53.08,39.51 90 top
R11  71.42,61.81 0 top
R12  71.4,57.85 0 top
R13  71.38,50.37 0 top
R14  71.36,53.89 0 top
R15  71.44,66.07 0 top
R17  61.41,43.41 0 top
R18  26.22,33.86 180 top
R19  60.46,6.84 270 top
R20  65.38,6.83 90 top
R21  55.39,6.83 90 top
R22  53.06,21.22 90 top
R23  53.06,27.8 90 top
R24  16.78,59.36 0 top
R25  16.76,62.99 0 top
R26  32.24,33.75 180 top
R27  8.87,44.53 270 top
R28  16.72,66.66 0 top
RESET_BUTTON  69.52,74.12 180 top
RTC_OSC  39.89,65.5 180 top
RV  10.51,55.76 0 top
SWD  54.46,75.74 0 top
U1  52.86,51.54 0 top
U2  15.26,49.77 90 top
U3  58.01,14.08 90 top
U4  9.57,19.47 90 top
U5  24.31,30.45 180 top
U7  34.35,28.61 0 top
U$3  66.27,32.46 270 top

### Tracks (layer width: path | path; a pad name or v marks a point on that pad's centre or on a via)
+5V
  Bottom 1.27: MOTION_SENSOR_CON.3 23.13,75.35 | 23.13,75.35 C28.1 | C16.1 23.13,73.26 23.13,75.35
  pour Top (rank 3): 28.47,28.64 28.47,85 -5,85 -5,28.63 28.48,28.63
+9V
  pour Top: 14.19,22.77 14.19,20.68 23.98,20.68 27.04,17.62 27.04,8.69 34.43,8.69 34.43,22.77
ADC1_IN9
  Top 0.305: U1.20 50.61,29.37 53.03,26.95 R23.1
  Top 0.61: R23.1 R22.2
AGND
  Top 0.305: U1.12 46.15,49.79 46.15,49.74 45.41,49 45.41,47.34 R9.1 C9.2
AVDD
  Top 0.305: U1.13 46.35,49.29 45.87,48.81 45.87,44.25 C9.1 44.02,42.32 FERRITE_BEAD.2
BAT_V_SYS_LOAD
  pour Top: 25.08,30.2 25.08,29.48 30.58,23.98 35.64,23.98 35.6,19.78 35.71,19.67 35.71,16.39 38.94,16.39 38.94,20.35 42.79,24.2 49.83,24.2 49.83,27.06 42.9,27.06 41.8,25.96 31.13,25.96 29.79,27.3 29.79,28.91 33.22,28.91 33.22,30.2 33.06,30.36 31.46,30.36 31.46,34.85 27.06,34.85 27.06,32.66 28.6,32.66 28.6,30.25
BAT_VIN
  pour Top (rank 2): 41.77,7.15 50.72,7.15 50.72,14.08 68.55,14.08 68.55,10.67 75.9,10.67 75.9,21.45 40.15,21.45 40.15,11 41.77,9.38
BOOT0
  Top 0.305: 51.79,59.47 R8.2 51.11,58.85 U1.60
DET  (via drill 0.35)
  Top 0.305: R15.1 70.61,66.07 70.61,64.63 64.15,58.17 v64.15,56.98 64.15,55.24 62.68,53.77 62.68,51.76 61.21,50.29 U1.38
  Bottom 0.305: J1.9 69.42,56.98 v64.15,56.98
FLAG_3.3V
  Top 0.381: U7.4 33.91,27.64 34.54,28.27
  Top 0.406: 34.54,28.27 34.54,32.3 R26.1
FLAG_5.0V
  Top 0.406: R18.2 25.37,32.05 26,31.43 U5.4
GND  (via drill 0.35, 0.5, 0.8)
  Top 0.305: U1.31 56.11,44.2 C15.2 54.26,44.33 v53.79,44.33 | 50.29,59.27 R8.1 | U1.18 49.61,45.08 C7.2 v47.96,41.78 v47.95,41.77 | U1.47 60.15,54.79 C6.2 v62.78,55.47 | U1.63 49.61,59.05 R8.1 | R8.1 C35.2 v48.48,61.04 | C2.2 35.14,61.56 v35.31,61.72 | v48.48,61.04 v48.49,61.05 | C1.2 48.19,60.75 v48.48,61.04 | R8.1 48.52,61.04 v48.48,61.04
  Top 0.381: U5.7 22.13,25.43 v22.11,25.41 | U7.7 v38.05,28.93 v38.06,28.93
  Top 0.406: R9.2 43.98,49.02 C5.2 43.12,48.26 v42.42,48.26 | C4.2 43.86,55.29 v43.94,55.37
  Top 0.457: U3.6 58.34,18.14
  Top 0.508: BATTERY-CONNECTOR.3 70.75,6.27 v70.73,6.27 | v58.35,18.16 58.34,18.14
  Top 0.61: C10.2 v29.26,36.96 C12.2 | RESET_BUTTON.4 v69.52,76.37 RESET_BUTTON.3 | C8.2 65.47,63.82 v65.45,63.8 | C31.1 72.27,45.01 72.27,44.77 | U$3.P$1 72.79,42.05 C30.1 72.18,45.1 C31.1 | C31.1 v73.69,45.16 | C19.2 50.12,5.06 v51.15,5.06 | C20.2 64.47,18.16 v58.35,18.16
  Top 0.813: C18.2 23.01,5.37 v22.99,5.39 | 52.98,32.19 BATTERY_LOW.C 53.02,32.42 v53.02,31.02 53.06,30.98 R23.2
  Bottom 0.305: U$3.P$23 58.84,24.87 58.84,25.58 59.93,26.66 74.21,26.66 U$3.P$35 | U$3.P$12 58.82,39.41 60.06,38.17 U$3.P$44
  pour Bottom (rank 2): -5,85 -5,-5 75,-5 75.02,45.43 81.84,45.43 81.84,84.81 81.65,85
  pour Top (rank 2): -5,23.9 11.7,23.9 12.06,23.54 12.06,9.48 16.7,4.84 16.7,-3.3 15,-5 -5,-5
  pour Top (rank 2): 20.95,16.34 20.95,6.07 20.7,5.82 15.79,5.82 15.79,0.6 16.28,0.11 26.66,0.11 26.66,16.34
  pour Top: 38.61,6.41 38.61,4.07 52.58,4.07 52.58,6.41
  pour Top: 23.43,32.23 23.43,28.6 20.13,28.6 20.13,32.23
  pour Top: 35.42,30.36 35.42,27.39 38.39,27.39 38.39,30.25 38.28,30.36
GREEN_LED+
  Top 0.457: POWER_STATUS.A R20.2
HTRC_DIN
  Top 0.508: R25.2 22.31,58.29 JP1.9
  Top 0.61: U2.9 17.8,51.61 18.59,50.82 20.68,50.82 21.21,51.35 21.21,53.69 22.1,54.58 22.86,54.58 23.55,55.27 23.55,56.23 22.38,57.4 JP1.9
HTRC_DOUT  (via drill 0.35)
  Top 0.61: R28.2 18.12,66.65 18.27,66.65 20.13,64.79 20.13,63.08 JP1.7 | U2.10 v16.53,55.03
  Bottom 0.61: v16.53,55.03 22.33,60.83 JP1.7
HTRC_GND  (via drill 0.35)
  Top 0.508: U2.1 11.45,44.89 C26.1 11.82,42.2 C25.1 | U2.5 16.53,45.63 17.32,44.84 C17.2 v18.83,44.49 C24.2
  Top 0.61: C25.1 11.64,42.02 v9.68,42.02 8.87,42.83 R27.2 | C13.2 9.66,60.37 v9.68,60.39 v9.69,60.4 C14.2
  pour Bottom: 23.65,68.86 23.65,39.82 1.98,39.82 1.98,68.86
HTRC_SCLK
  Top 0.61: U2.8 19.07,54.16 20.66,55.75 JP1.11 18.77,59.36 R24.2
HTRC_VDD
  pour Top (rank 2): 23.65,64.79 19.91,64.79 18.48,63.36 18.48,54.12 9.9,53.96 9.9,45.54 13.2,45.54 13.2,48.51 15.29,48.51 15.29,40.48 3.74,40.48 3.74,69.05 19.14,68.86 19.25,68.86 21.18,66.93 23.6,66.93 23.65,66.88
LED_GREEN
  Top 0.305: U1.21 51.11,42.88 R10.2
N$1
  Bottom 0.508: L3.1 11.09,30.45 J4.1_B
  Bottom 0.61: J4.1_B J4.1_A 3.34,30.87 1.32,32.89 1.32,42.65 C33.1
N$2
  Top 0.305: R10.1 53.08,35.4 BATTERY_LOW.A
N$3  (via drill 0.35)
  other vias: 39.12,60.96
N$4  (via drill 0.35)
  other vias: 40.13,60.96
N$5  (via drill 0.35)
  other vias: 41.15,60.96
N$6
  Top 0.305: U1.3 46.01,54.29 45.56,54.74 45.56,58.6 C1.1 41.49,62.67 RTC_OSC.1
N$7
  Top 0.61: L2.1 5.96,38.15 J4.2_A
  Bottom 0.61: J4.2_B J4.2_A 3.34,41.18 5.33,43.17 C29.1
N$8
  Top 0.305: U1.4 45.66,53.79 44.96,54.49 44.96,57.66 42.93,59.69 39.12,59.69 38.35,60.45 | C2.1 36,59.69 37.59,59.69 38.35,60.45 | 38.35,60.45 38.35,62.69 RTC_OSC.4
N$9  (via drill 0.35)
  other vias: 42.16,60.96
N$10
  Top 0.61: C34.1 6.4,47.74
  pour Top: 5.06,48.07 5.06,44.44 9.13,44.44 9.13,48.07
N$11
  Top 0.61: C13.1 12.72,57.36 U2.13
N$12  (via drill 0.35)
  Top 0.61: C34.2 6.36,52.46 v7.31,53.41 RV.1
  Bottom 0.508: CA.2 15.75,41.69 L3.2 13.82,37.91 10.67,41.06 10.67,50.05 v7.31,53.41
N$13  (via drill 0.35)
  other vias: 42.42,64.01
N$14
  Top 0.406: R21.1 57.69,8.28 U3.2
  Top 1.27: Q2.4 42.73,22.7 42.73,18.09 39.49,14.85 CR3.2 37.07,14.08 37.07,10.77 | CR1.1 37.07,10.77 | R7.2 37.18,10.77 37.07,10.77
  pour Top (rank 4): 27.39,6.93 27.39,0.11 67.76,0.11 67.76,6.71 53.9,6.71 53.9,3.19 38.5,3.19 37.95,3.74 37.95,6.82 37.84,6.93
N$15
  Top 0.406: U3.4 58.98,10.05 60.46,8.58 R19.1
N$16
  Top 0.457: U3.3 58.34,13.02 59.45,14.13 POWER_STATUS.C
N$17  (via drill 0.35)
  other vias: 42.42,65.02
N$18
  Top 0.457: Q1.4 49.01,12.93 52.2,16.12 U3.8
N$19
  Top 0.406: 57.03,11.53 U3.1
  pour Top: 44.11,13.42 44.11,10.23 54.45,10.23 54.45,7.48 57.53,7.48 57.53,13.42
N$20
  Top 0.457: U3.5 58.98,16.75 59.4,17.16 65.08,17.16
  Top 0.508: 65.08,17.16 C20.1
N$21
  Top 0.61: C14.1 13.99,59.2 U2.12
N$22  (via drill 0.35)
  other vias: 42.42,66.04
N$23  (via drill 0.35)
  other vias: 42.42,67.06
N$24  (via drill 0.35)
  other vias: 42.42,69.6
N$25  (via drill 0.35)
  other vias: 41.15,70.1
N$26  (via drill 0.35)
  other vias: 40.13,70.1
N$27
  Top 0.305: U$3.P$6 66.44,41.39 64.42,43.41 R17.2
N$28  (via drill 0.35)
  other vias: 39.12,70.1
N$29  (via drill 0.35)
  other vias: 38.1,70.1
N$30  (via drill 0.35)
  other vias: 37.08,69.6
N$31  (via drill 0.35)
  other vias: 37.08,67.06
N$32  (via drill 0.35)
  other vias: 37.08,66.04
N$33  (via drill 0.35)
  other vias: 37.08,65.02
N$34  (via drill 0.35)
  other vias: 37.08,64.01
N$35  (via drill 0.35)
  other vias: 38.1,58.93
N$36  (via drill 0.35)
  other vias: 37.08,57.91
N$37  (via drill 0.35)
  other vias: 37.08,56.64
N$38  (via drill 0.35)
  other vias: 37.08,55.12
N$39  (via drill 0.35)
  other vias: 37.08,53.59
N$40  (via drill 0.35)
  other vias: 37.08,51.82
N$41  (via drill 0.35)
  other vias: 37.08,50.04
N$43  (via drill 0.35)
  other vias: 37.08,46.99
N$44  (via drill 0.35)
  other vias: 37.08,45.47
N$45  (via drill 0.35)
  other vias: 38.1,44.2
N$46  (via drill 0.35)
  other vias: 39.37,42.93
N$47  (via drill 0.35)
  other vias: 40.39,42.93
N$48  (via drill 0.35)
  other vias: 41.4,44.2
N$49  (via drill 0.35)
  other vias: 42.42,45.47
N$50  (via drill 0.35)
  other vias: 42.42,47.24
N$51  (via drill 0.35)
  other vias: 42.42,50.55
N$52  (via drill 0.35)
  other vias: 42.42,52.32
N$54  (via drill 0.35)
  other vias: 42.42,56.39
N$55  (via drill 0.35)
  other vias: 42.42,57.91
N$56  (via drill 0.35)
  other vias: 41.66,58.93
NRST  (via drill 0.35, 0.5)
  Top 0.305: v51.37,52.36 51.3,52.29 U1.7 | R2.1 54.98,63.82 v55,63.8 | C8.1 64.57,66.83 55.8,66.83 R2.1 | R5.2 54.96,65.99 R2.1
  Top 0.61: RESET_BUTTON.1 RESET_BUTTON.2 65.55,68.36 C8.1
  Bottom 0.305: v55,63.8 55,55.99 v51.37,52.36
OSC_IN
  Top 0.305: U1.5 44.91,53.28 C4.1 | C4.1 43.79,52.16 | C4.1 43.82,52.24 8MHZ_OSC.2
OSC_OUT
  Top 0.305: U1.6 46.43,52.79 44.41,50.77 C5.1 39.89,46.73 8MHZ_OSC.1
  Top 0.508: U2.6 17.8,48.16 18.16,48.52 19.5,48.52 19.66,48.37 C24.1 35.14,48.37
  Top 0.61: 35.14,48.37 38.19,48.37 8MHZ_OSC.1
RESET_N
  Top 0.305: U1.23 52.11,44.36 56.1,40.37 | R17.1 59.14,43.41 56.1,40.37 | U$3.P$29 66.44,23.32 65.67,22.55 58.08,22.55 56.1,24.53 56.1,40.37
RF_CS
  Top 0.305: U1.54 54.11,58.73 54.12,58.74 54.12,58.85 51.04,61.93 47.54,61.93 44.7,64.77 44.7,68.58 42.42,70.87 37.22,70.87 27.2,60.85 27.2,55.49 JP1.14
RX
  Top 0.61: RV.2 11.36,52.51 U2.14
SD_CS  (via drill 0.35)
  Top 0.305: R11.1 69.09,61.81 66.36,59.09 66.36,56.42 v64.1,54.16 63.33,53.39 63.33,51.45 61.67,49.79 U1.37
  Bottom 0.305: J1.2 64.55,54.61 v64.1,54.16
SPI2_MISO  (via drill 0.35)
  Top 0.305: R14.1 67.76,53.89 v64.13,50.26 62.66,48.79 U1.35
  Bottom 0.305: J1.7 65.28,49.11 v64.13,50.26
SPI2_MOSI  (via drill 0.35)
  Top 0.305: 64.18,53.07 68.98,57.87 70.53,57.87 R12.1 | v64.13,53.07 64.18,53.07 | 64.18,53.07 63.79,52.68 63.79,50.93 62.15,49.29 U1.36
  Bottom 0.305: J1.3 64.57,53.51 v64.13,53.07
SPI2_SCK  (via drill 0.35)
  Top 0.305: R13.1 67.23,50.37 67.22,50.38 v65.67,50.38 63.58,48.29 U1.34
  Bottom 0.305: 67.16,51.31 J1.5 66.6,51.31 v65.67,50.38
SPI3_MISO
  Top 0.305: U1.52 55.11,59.83 51.65,63.29 47.69,63.29 45.72,65.26 45.72,69.09 42.87,71.94 36.03,71.94 29.72,65.63 JP1.8
SPI3_MOSI
  Top 0.305: U1.53 54.61,59.41 51.41,62.61 47.75,62.61 47.53,62.83 47.5,62.83 45.21,65.12 45.21,68.83 42.67,71.37 37.02,71.37 24.92,59.27 JP1.10
SPI3_SCK  (via drill 0.35)
  Top 0.305: U1.51 55.63,57.31 55.63,60.23 51.95,63.91 47.72,63.91 46.23,65.4 46.23,69.34 43.17,72.4 35.12,72.4 v28.28,65.56
  Bottom 0.305: JP1.12 28.28,59.11 v28.28,65.56
SWO
  Top 0.305: R6.2 58.52,56.98 57.6,56.06 54.16,56.06 53.61,56.61 U1.55
SYS_WAKEUP  (via drill 0.5)
  Top 0.305: U1.14 v48.95,48.79 48.45,48.29 U1.15
  Bottom 0.305: v48.95,48.79 43.79,53.95 40.11,57.63 40.11,58.22 27.73,70.59 20.22,70.59 15.46,75.35 MOTION_SENSOR_CON.2
T_JTCK
  Top 0.61: R3.1 47.84,72.93 SWD.2
T_JTMS
  Top 0.61: SWD.4 55.78,75.74 57.77,77.72 61.31,77.72 62.1,76.94 R4.1
T_NRST
  Top 0.61: SWD.5 58.27,75.13 R5.1
T_SWO
  Top 0.61: SWD.6 58.52,73.45 R6.1
TCK
  Top 0.254: U1.49 56.61,60.23 52.28,64.56 48.89,64.56 R3.2
TMS  (via drill 0.35)
  Top 0.305: v62.1,54.29 U1.46 | v62.1,63.77 R4.2
  Bottom 0.305: v62.1,63.77 v62.1,54.29
TX1
  Top 0.508: U2.4 15.26,47.65 | U2.4 15.26,48.59 15.29,48.62 14.19,49.72 9.05,49.72 CS.1 | U2.4 15.26,45.68 15.62,45.32 C17.1
  Top 0.61: U2.4 15.27,47.11
TX2  (via drill 0.35)
  Top 0.508: v12.76,48.94 12.76,47.16 U2.2
  Bottom 0.508: CA.1 12.76,46.38 v12.76,48.94 12.76,43.55 C27.1
USART1_CTS  (via drill 0.5)
  Top 0.305: v56.87,52.74 56.89,52.74 57.44,53.29 U1.44
  Bottom 0.305: v56.87,52.74 v56.88,52.73 56.88,24.45 58.11,23.21 66.77,23.21 67.71,24.15 U$3.P$30
USART1_RTS  (via drill 0.5)
  Top 0.305: U1.45 v55.92,53.79
  Bottom 0.305: v55.92,53.79 55.92,24.21 57.91,22.22 66.99,22.22 68.98,24.21 U$3.P$31
USART1_RX  (via drill 0.5)
  Top 0.305: U1.43 60.04,52.79 v60.08,52.83
  Bottom 0.305: v60.08,52.83 U$3.P$11
USART1_TX  (via drill 0.35)
  Top 0.305: U1.42 59.55,52.29 59.77,52.07 61.01,52.07 v61.38,51.7
  Bottom 0.305: v61.38,51.7 61.38,40.09 U$3.P$10
VDD  (via drill 0.35)
  Top 0.305: U1.19 50.11,43.88 C7.1
  Top 1.27: JP1.4 34.75,75.74 SWD.1
  Bottom 0.61: R1.1 48.11,72.79 SWD.1 | J1.4 68.48,52.41 v68.53,52.36
  pour Top (rank 2): 30,85 30,23.02 75,23.02 75,43.43 81.73,50.16 81.73,84.92 75,85
VIN
  pour Top: 14.41,18.26 14.41,9.24 16.72,6.93 20.02,6.93 20.02,18.26
WIFI_EN  (via drill 0.5)
  Top 0.305: U1.41 v55.09,51.79
  Bottom 0.305: U$3.P$33 71.52,23.12 69.55,21.15 57.72,21.15 55.09,23.78 v55.09,51.79

### Text on the board
tPlace: GND OUTPUT +5V | VDD JCK GND JMS NRST SWO | 6=SPI_SCK 4=SPI_MISO 2=VDD | 7=RF_CS 5=SPI_MOSI 3=GND
bPlace: Cat LitterBox+ / / Team Members: / Haoda Gong / Ruitao Long / Shiqi Yu / Tianyang Shi / Yechen Shi